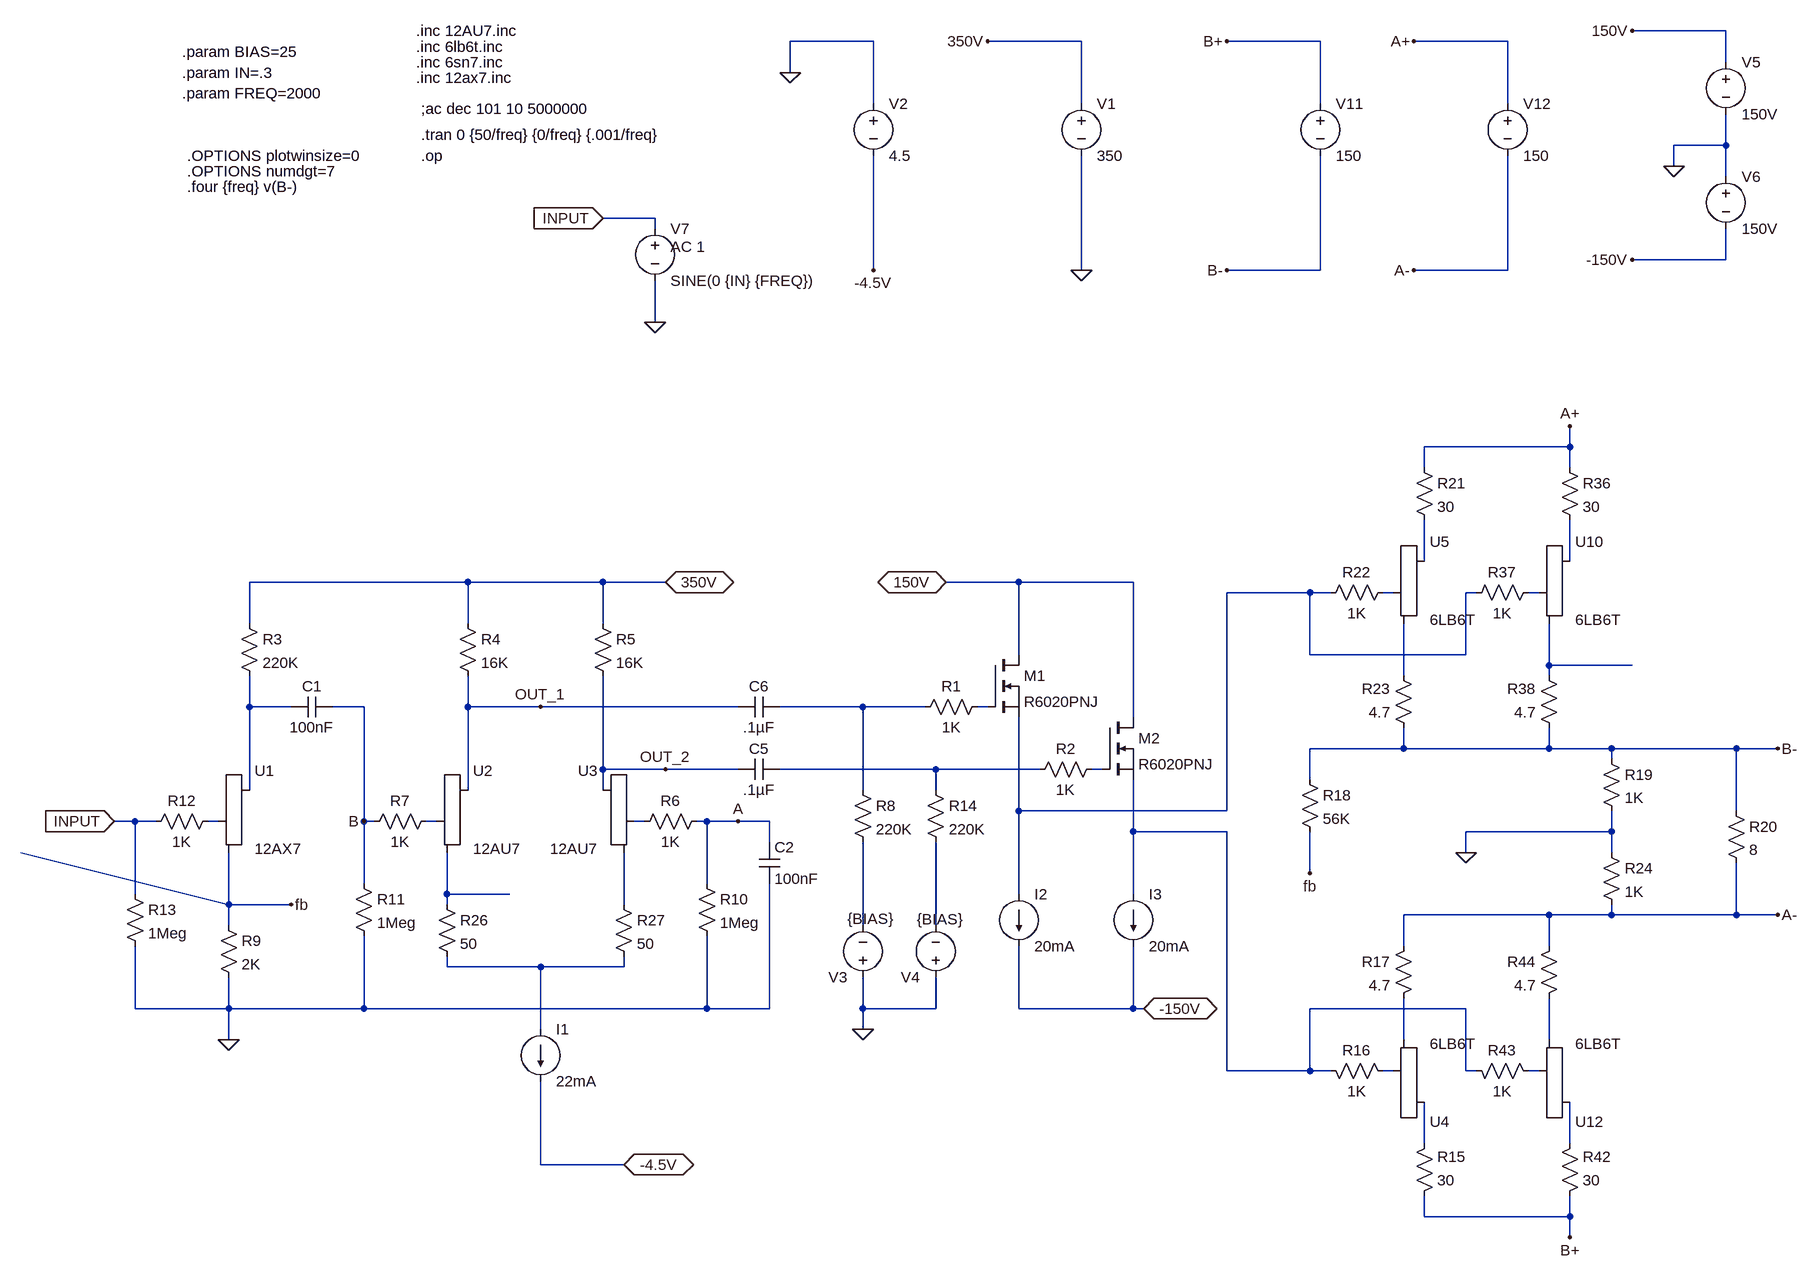
[diagram p0: schematic Bookshelf OTL audio circuitry V2 SIM.asc]
Bookshelf OTL audio circuitry V2 SIM.asc, the LTspice schematic file:
Version 4
SHEET 1 1596 3072
WIRE -1840 -528 -1984 -528
WIRE -3152 -512 -3280 -512
WIRE -2832 -512 -2976 -512
WIRE -2464 -512 -2608 -512
WIRE -2176 -512 -2320 -512
WIRE -1840 -480 -1840 -528
WIRE -3280 -464 -3280 -512
WIRE -3152 -416 -3152 -512
WIRE -2832 -416 -2832 -512
WIRE -2464 -416 -2464 -512
WIRE -2176 -416 -2176 -512
WIRE -1840 -352 -1840 -400
WIRE -1840 -352 -1920 -352
WIRE -1920 -320 -1920 -352
WIRE -1840 -304 -1840 -352
WIRE -3488 -240 -3568 -240
WIRE -3488 -224 -3488 -240
WIRE -1840 -176 -1840 -224
WIRE -1840 -176 -1984 -176
WIRE -3152 -160 -3152 -336
WIRE -2832 -160 -2832 -336
WIRE -2464 -160 -2464 -336
WIRE -2464 -160 -2608 -160
WIRE -2176 -160 -2176 -336
WIRE -2176 -160 -2320 -160
WIRE -3488 -80 -3488 -144
WIRE -2080 112 -2080 80
WIRE -2080 112 -2304 112
WIRE -2304 144 -2304 112
WIRE -2080 144 -2080 112
WIRE -2304 288 -2304 224
WIRE -2080 288 -2080 224
WIRE -3776 320 -4112 320
WIRE -3568 320 -3776 320
WIRE -3472 320 -3568 320
WIRE -2928 320 -3040 320
WIRE -2752 320 -2928 320
WIRE -2480 336 -2608 336
WIRE -2448 336 -2480 336
WIRE -2352 336 -2368 336
WIRE -2224 336 -2240 336
WIRE -2128 336 -2144 336
WIRE -4112 384 -4112 320
WIRE -3776 384 -3776 320
WIRE -3568 384 -3568 320
WIRE -2928 432 -2928 320
WIRE -2480 432 -2480 336
WIRE -2240 432 -2240 336
WIRE -2240 432 -2480 432
WIRE -2112 448 -2112 384
WIRE -1984 448 -2112 448
WIRE -2336 464 -2336 384
WIRE -2112 464 -2112 448
WIRE -4112 512 -4112 464
WIRE -4048 512 -4112 512
WIRE -3936 512 -3984 512
WIRE -3776 512 -3776 464
WIRE -3664 512 -3776 512
WIRE -3360 512 -3664 512
WIRE -3168 512 -3296 512
WIRE -3072 512 -3168 512
WIRE -2976 512 -2992 512
WIRE -2752 528 -2752 320
WIRE -2336 576 -2336 544
WIRE -2336 576 -2480 576
WIRE -2112 576 -2112 544
WIRE -2112 576 -2336 576
WIRE -2016 576 -2112 576
WIRE -1824 576 -2016 576
WIRE -1760 576 -1824 576
WIRE -2016 592 -2016 576
WIRE -3568 608 -3568 464
WIRE -3472 608 -3568 608
WIRE -3360 608 -3472 608
WIRE -3056 608 -3296 608
WIRE -2896 608 -3056 608
WIRE -2800 608 -2816 608
WIRE -2480 624 -2480 576
WIRE -4112 640 -4112 512
WIRE -3776 640 -3776 512
WIRE -3568 640 -3568 608
WIRE -3168 640 -3168 512
WIRE -3056 640 -3056 608
WIRE -2928 672 -2928 528
WIRE -2608 672 -2608 336
WIRE -2608 672 -2928 672
WIRE -1824 672 -1824 576
WIRE -4288 688 -4320 688
WIRE -4256 688 -4288 688
WIRE -4160 688 -4176 688
WIRE -3936 688 -3936 512
WIRE -3920 688 -3936 688
WIRE -3824 688 -3840 688
WIRE -3504 688 -3520 688
WIRE -3408 688 -3424 688
WIRE -3360 688 -3408 688
WIRE -3312 688 -3360 688
WIRE -2752 704 -2752 624
WIRE -2608 704 -2752 704
WIRE -2016 704 -2016 672
WIRE -2016 704 -2240 704
WIRE -3312 720 -3312 688
WIRE -2240 736 -2240 704
WIRE -2016 736 -2016 704
WIRE -2480 768 -2480 704
WIRE -3936 784 -3936 688
WIRE -3408 784 -3408 688
WIRE -4288 800 -4288 688
WIRE -3808 800 -3808 736
WIRE -3712 800 -3808 800
WIRE -2928 800 -2928 672
WIRE -2752 800 -2752 704
WIRE -4144 816 -4464 736
WIRE -4144 816 -4144 736
WIRE -4048 816 -4144 816
WIRE -3808 816 -3808 800
WIRE -3536 816 -3536 736
WIRE -2112 832 -2336 832
WIRE -2016 832 -2016 816
WIRE -2016 832 -2112 832
WIRE -1824 832 -1824 752
WIRE -1824 832 -2016 832
WIRE -1760 832 -1824 832
WIRE -4144 848 -4144 816
WIRE -3168 848 -3168 720
WIRE -3056 848 -3056 720
WIRE -2336 880 -2336 832
WIRE -2112 880 -2112 832
WIRE -3808 912 -3808 896
WIRE -3664 912 -3808 912
WIRE -3536 912 -3536 896
WIRE -3536 912 -3664 912
WIRE -4288 976 -4288 880
WIRE -4144 976 -4144 928
WIRE -4144 976 -4288 976
WIRE -3936 976 -3936 864
WIRE -3936 976 -4144 976
WIRE -3408 976 -3408 864
WIRE -3408 976 -3936 976
WIRE -3312 976 -3312 784
WIRE -3312 976 -3408 976
WIRE -3168 976 -3168 928
WIRE -3056 976 -3056 928
WIRE -3056 976 -3168 976
WIRE -2928 976 -2928 880
WIRE -2752 976 -2752 880
WIRE -2752 976 -2928 976
WIRE -2736 976 -2752 976
WIRE -2240 976 -2480 976
WIRE -3664 1008 -3664 912
WIRE -3168 1008 -3168 976
WIRE -4144 1024 -4144 976
WIRE -2336 1024 -2336 960
WIRE -2112 1024 -2112 960
WIRE -2608 1072 -2608 704
WIRE -2480 1072 -2480 976
WIRE -2480 1072 -2608 1072
WIRE -2448 1072 -2480 1072
WIRE -2352 1072 -2368 1072
WIRE -2240 1072 -2240 976
WIRE -2224 1072 -2240 1072
WIRE -2128 1072 -2144 1072
WIRE -2304 1184 -2304 1120
WIRE -2080 1184 -2080 1120
WIRE -3664 1216 -3664 1088
WIRE -3536 1216 -3664 1216
WIRE -2304 1296 -2304 1264
WIRE -2080 1296 -2080 1264
WIRE -2080 1296 -2304 1296
WIRE -2080 1328 -2080 1296
FLAG -2240 736 0
FLAG -1760 576 B-
FLAG -1760 832 A-
FLAG -2608 -512 B+
FLAG -2608 -160 B-
FLAG -2320 -512 A+
FLAG -2320 -160 A-
FLAG -2080 80 A+
FLAG -2080 1328 B+
FLAG -3472 320 350V
IOPIN -3472 320 BiDir
FLAG -3536 1216 -4.5V
IOPIN -3536 1216 BiDir
FLAG -4144 1024 0
FLAG -3664 512 OUT_1
FLAG -3472 608 OUT_2
FLAG -4320 688 INPUT
IOPIN -4320 688 In
FLAG -2976 -512 350V
FLAG -2832 -160 0
FLAG -3152 -160 -4.5V
FLAG -3280 -464 0
FLAG -3040 320 150V
IOPIN -3040 320 BiDir
FLAG -2736 976 -150V
IOPIN -2736 976 BiDir
FLAG -3168 1008 0
FLAG -1984 -528 150V
FLAG -1984 -176 -150V
FLAG -1920 -320 0
FLAG -3568 -240 INPUT
IOPIN -3568 -240 In
FLAG -3488 -80 0
FLAG -3936 688 B
FLAG -3360 688 A
FLAG -2480 768 fb
FLAG -4048 816 fb
DATAFLAG -1984 448 ""
DATAFLAG -2016 576 ""
DATAFLAG -2016 832 ""
DATAFLAG -3776 512 ""
DATAFLAG -3568 608 ""
DATAFLAG -4112 512 ""
DATAFLAG -3664 912 ""
DATAFLAG -3152 -256 ""
DATAFLAG -4464 736 ""
DATAFLAG -3712 800 ""
SYMBOL res -1840 656 R0
SYMATTR InstName R20
SYMATTR Value 8
SYMBOL voltage -2464 -432 R0
WINDOW 123 0 0 Left 0
WINDOW 39 0 0 Left 0
SYMATTR InstName V11
SYMATTR Value 150
SYMBOL voltage -2176 -432 R0
WINDOW 123 0 0 Left 0
WINDOW 39 0 0 Left 0
SYMATTR InstName V12
SYMATTR Value 150
SYMBOL res -2096 128 R0
SYMATTR InstName R36
SYMATTR Value 30
SYMBOL res -2128 320 R90
WINDOW 0 0 56 VBottom 2
WINDOW 3 32 56 VTop 2
SYMATTR InstName R37
SYMATTR Value 1K
SYMBOL res -2096 560 R180
WINDOW 0 36 76 Left 2
WINDOW 3 36 40 Left 2
SYMATTR InstName R38
SYMATTR Value 4.7
SYMBOL Misc\\triode -2080 336 R0
SYMATTR InstName U10
SYMATTR Value 6LB6T
SYMBOL res -2096 1280 M180
WINDOW 0 36 76 Left 2
WINDOW 3 36 40 Left 2
SYMATTR InstName R42
SYMATTR Value 30
SYMBOL res -2128 1088 M270
WINDOW 0 32 56 VTop 2
WINDOW 3 0 56 VBottom 2
SYMATTR InstName R43
SYMATTR Value 1K
SYMBOL res -2096 864 M0
SYMATTR InstName R44
SYMATTR Value 4.7
SYMBOL Misc\\triode -2080 1072 M180
SYMATTR InstName U12
SYMATTR Value 6LB6T
SYMBOL Misc\\triode -3776 688 R0
SYMATTR InstName U2
SYMATTR Value 12AU7
SYMBOL Misc\\triode -3568 688 M0
SYMATTR InstName U3
SYMATTR Value 12AU7
SYMBOL res -4128 368 R0
SYMATTR InstName R3
SYMATTR Value 220K
SYMBOL res -3792 368 R0
SYMATTR InstName R4
SYMATTR Value 16K
SYMBOL res -3584 368 R0
SYMATTR InstName R5
SYMATTR Value 16K
SYMBOL res -3408 672 R90
WINDOW 0 0 56 VBottom 2
WINDOW 3 32 56 VTop 2
SYMATTR InstName R6
SYMATTR Value 1K
SYMBOL res -3824 672 R90
WINDOW 0 0 56 VBottom 2
WINDOW 3 32 56 VTop 2
SYMATTR InstName R7
SYMATTR Value 1K
SYMBOL res -4160 832 R0
SYMATTR InstName R9
SYMATTR Value 2K
SYMBOL res -3424 768 R0
SYMATTR InstName R10
SYMATTR Value 1Meg
SYMBOL res -3952 768 R0
SYMATTR InstName R11
SYMATTR Value 1Meg
SYMBOL res -4160 672 R90
WINDOW 0 0 56 VBottom 2
WINDOW 3 32 56 VTop 2
SYMATTR InstName R12
SYMATTR Value 1K
SYMBOL res -4304 784 R0
SYMATTR InstName R13
SYMATTR Value 1Meg
SYMBOL cap -3296 592 R90
WINDOW 0 0 32 VBottom 2
WINDOW 3 32 32 VTop 2
SYMATTR InstName C5
SYMATTR Value .1µF
SYMBOL cap -3360 528 R270
WINDOW 0 32 32 VTop 2
WINDOW 3 0 32 VBottom 2
SYMATTR InstName C6
SYMATTR Value .1µF
SYMBOL current -3664 1008 R0
WINDOW 123 0 0 Left 0
WINDOW 39 0 0 Left 0
SYMATTR InstName I1
SYMATTR Value 22mA
SYMBOL voltage -2832 -432 R0
WINDOW 123 0 0 Left 0
WINDOW 39 0 0 Left 0
SYMATTR InstName V1
SYMATTR Value 350
SYMBOL voltage -3152 -432 R0
WINDOW 123 0 0 Left 0
WINDOW 39 0 0 Left 0
SYMATTR InstName V2
SYMATTR Value 4.5
SYMBOL nmos -2976 432 R0
SYMATTR InstName M1
SYMATTR Value R6020PNJ
SYMBOL nmos -2800 528 R0
SYMATTR InstName M2
SYMATTR Value R6020PNJ
SYMBOL res -2976 496 R90
WINDOW 0 0 56 VBottom 2
WINDOW 3 32 56 VTop 2
SYMATTR InstName R1
SYMATTR Value 1K
SYMBOL res -2800 592 R90
WINDOW 0 0 56 VBottom 2
WINDOW 3 32 56 VTop 2
SYMATTR InstName R2
SYMATTR Value 1K
SYMBOL current -2928 800 R0
WINDOW 123 0 0 Left 0
WINDOW 39 0 0 Left 0
SYMATTR InstName I2
SYMATTR Value 20mA
SYMBOL current -2752 800 R0
WINDOW 123 0 0 Left 0
WINDOW 39 0 0 Left 0
SYMATTR InstName I3
SYMATTR Value 20mA
SYMBOL res -3184 624 R0
SYMATTR InstName R8
SYMATTR Value 220K
SYMBOL res -3072 624 R0
SYMATTR InstName R14
SYMATTR Value 220K
SYMBOL voltage -3168 944 R180
WINDOW 123 0 0 Left 0
WINDOW 39 0 0 Left 0
WINDOW 3 -47 106 Left 2
SYMATTR Value {BIAS}
SYMATTR InstName V3
SYMBOL voltage -3056 944 R180
WINDOW 123 0 0 Left 0
WINDOW 39 0 0 Left 0
WINDOW 3 -42 105 Left 2
SYMATTR Value {BIAS}
SYMATTR InstName V4
SYMBOL voltage -1840 -496 R0
WINDOW 123 0 0 Left 0
WINDOW 39 0 0 Left 0
SYMATTR InstName V5
SYMATTR Value 150V
SYMBOL voltage -1840 -320 R0
WINDOW 123 0 0 Left 0
WINDOW 39 0 0 Left 0
SYMATTR InstName V6
SYMATTR Value 150V
SYMBOL voltage -3488 -240 R0
WINDOW 123 24 44 Left 2
WINDOW 39 0 0 Left 0
SYMATTR Value2 AC 1
SYMATTR InstName V7
SYMATTR Value SINE(0 {IN} {FREQ})
SYMBOL Misc\\triode -4112 688 R0
SYMATTR InstName U1
SYMATTR Value 12AX7
SYMBOL cap -3984 496 R90
WINDOW 0 0 32 VBottom 2
WINDOW 3 32 32 VTop 2
SYMATTR InstName C1
SYMATTR Value 100nF
SYMBOL res -2320 1280 M180
WINDOW 0 36 76 Left 2
WINDOW 3 36 40 Left 2
SYMATTR InstName R15
SYMATTR Value 30
SYMBOL res -2352 1088 M270
WINDOW 0 32 56 VTop 2
WINDOW 3 0 56 VBottom 2
SYMATTR InstName R16
SYMATTR Value 1K
SYMBOL res -2320 864 M0
SYMATTR InstName R17
SYMATTR Value 4.7
SYMBOL Misc\\triode -2304 1072 M180
SYMATTR InstName U4
SYMATTR Value 6LB6T
SYMBOL res -2320 128 R0
SYMATTR InstName R21
SYMATTR Value 30
SYMBOL res -2352 320 R90
WINDOW 0 0 56 VBottom 2
WINDOW 3 32 56 VTop 2
SYMATTR InstName R22
SYMATTR Value 1K
SYMBOL res -2320 560 R180
WINDOW 0 36 76 Left 2
WINDOW 3 36 40 Left 2
SYMATTR InstName R23
SYMATTR Value 4.7
SYMBOL Misc\\triode -2304 336 R0
SYMATTR InstName U5
SYMATTR Value 6LB6T
SYMBOL res -2032 576 R0
SYMATTR InstName R19
SYMATTR Value 1K
SYMBOL res -2032 720 R0
SYMATTR InstName R24
SYMATTR Value 1K
SYMBOL res -3824 800 R0
SYMATTR InstName R26
SYMATTR Value 50
SYMBOL res -3552 800 R0
SYMATTR InstName R27
SYMATTR Value 50
SYMBOL cap -3328 720 R0
SYMATTR InstName C2
SYMATTR Value 100nF
SYMBOL res -2496 608 R0
SYMATTR InstName R18
SYMATTR Value 56K
TEXT -4208 -336 Left 2 !.OPTIONS plotwinsize=0
TEXT -4208 -312 Left 2 !.OPTIONS numdgt=7
TEXT -4216 -432 Left 2 !.param FREQ=2000
TEXT -4216 -464 Left 2 !.param IN=.3
TEXT -3848 -368 Left 2 !.tran 0 {50/freq} {0/freq} {.001/freq}
TEXT -3848 -336 Left 2 !.op
TEXT -3848 -408 Left 2 !;ac dec 101 10 5000000
TEXT -4216 -496 Left 2 !.param BIAS=25
TEXT -3856 -504 Left 2 !.inc 6lb6t.inc
TEXT -4208 -288 Left 2 !.four {freq} v(B-)
TEXT -3856 -480 Left 2 !.inc 6sn7.inc
TEXT -3856 -456 Left 2 !.inc 12ax7.inc
TEXT -3856 -528 Left 2 !.inc 12AU7.inc

The netlist it stands for:
* Bookshelf OTL audio circuitry V2 SIM.asc
R20 B- A- 8
V11 B+ B- 150
V12 A+ A- 150
R36 A+ N002 30
R37 N005 N003 1K
R38 B- N006 4.7
XU10 N002 N005 N006 6LB6T
R42 B+ N027 30
R43 N025 N016 1K
R44 A- N023 4.7
XU12 N027 N025 N023 6LB6T
XU2 OUT_1 N014 N017 12AU7
XU3 OUT_2 N015 N018 12AU7
R3 350V N008 220K
R4 350V OUT_1 16K
R5 350V OUT_2 16K
R6 A N015 1K
R7 N014 B 1K
R9 fb 0 2K
R10 A 0 1Meg
R11 B 0 1Meg
R12 N013 INPUT 1K
R13 INPUT 0 1Meg
C5 N011 OUT_2 .1µF
C6 OUT_1 N009 .1µF
I1 N021 -4.5V 22mA
V1 350V 0 350
V2 0 -4.5V 4.5
M1 150V N010 N003 N003 R6020PNJ
M2 150V N012 N016 N016 R6020PNJ
R1 N010 N009 1K
R2 N012 N011 1K
I2 N003 -150V 20mA
I3 N016 -150V 20mA
R8 N009 N019 220K
R14 N011 N020 220K
V3 0 N019 {BIAS}
V4 0 N020 {BIAS}
V5 150V 0 150V
V6 0 -150V 150V
V7 INPUT 0 SINE(0 {IN} {FREQ}) AC 1
XU1 N008 N013 fb 12AX7
C1 B N008 100nF
R15 B+ N026 30
R16 N024 N016 1K
R17 A- N022 4.7
XU4 N026 N024 N022 6LB6T
R21 A+ N001 30
R22 N004 N003 1K
R23 B- N007 4.7
XU5 N001 N004 N007 6LB6T
R19 B- 0 1K
R24 0 A- 1K
R26 N017 N021 50
R27 N018 N021 50
C2 A 0 100nF
R18 B- fb 56K
.model NMOS NMOS
.model PMOS PMOS
.lib standard.mos
.OPTIONS plotwinsize=0
.OPTIONS numdgt=7
.param FREQ=2000
.param IN=.3
.tran 0 {50/freq} {0/freq} {.001/freq}
.op
;ac dec 101 10 5000000
.param BIAS=25
.inc 6lb6t.inc
.four {freq} v(B-)
.inc 6sn7.inc
.inc 12ax7.inc
.inc 12AU7.inc
.backanno
.end